# Altium schematic sheet SIM800.SchDoc
size A3
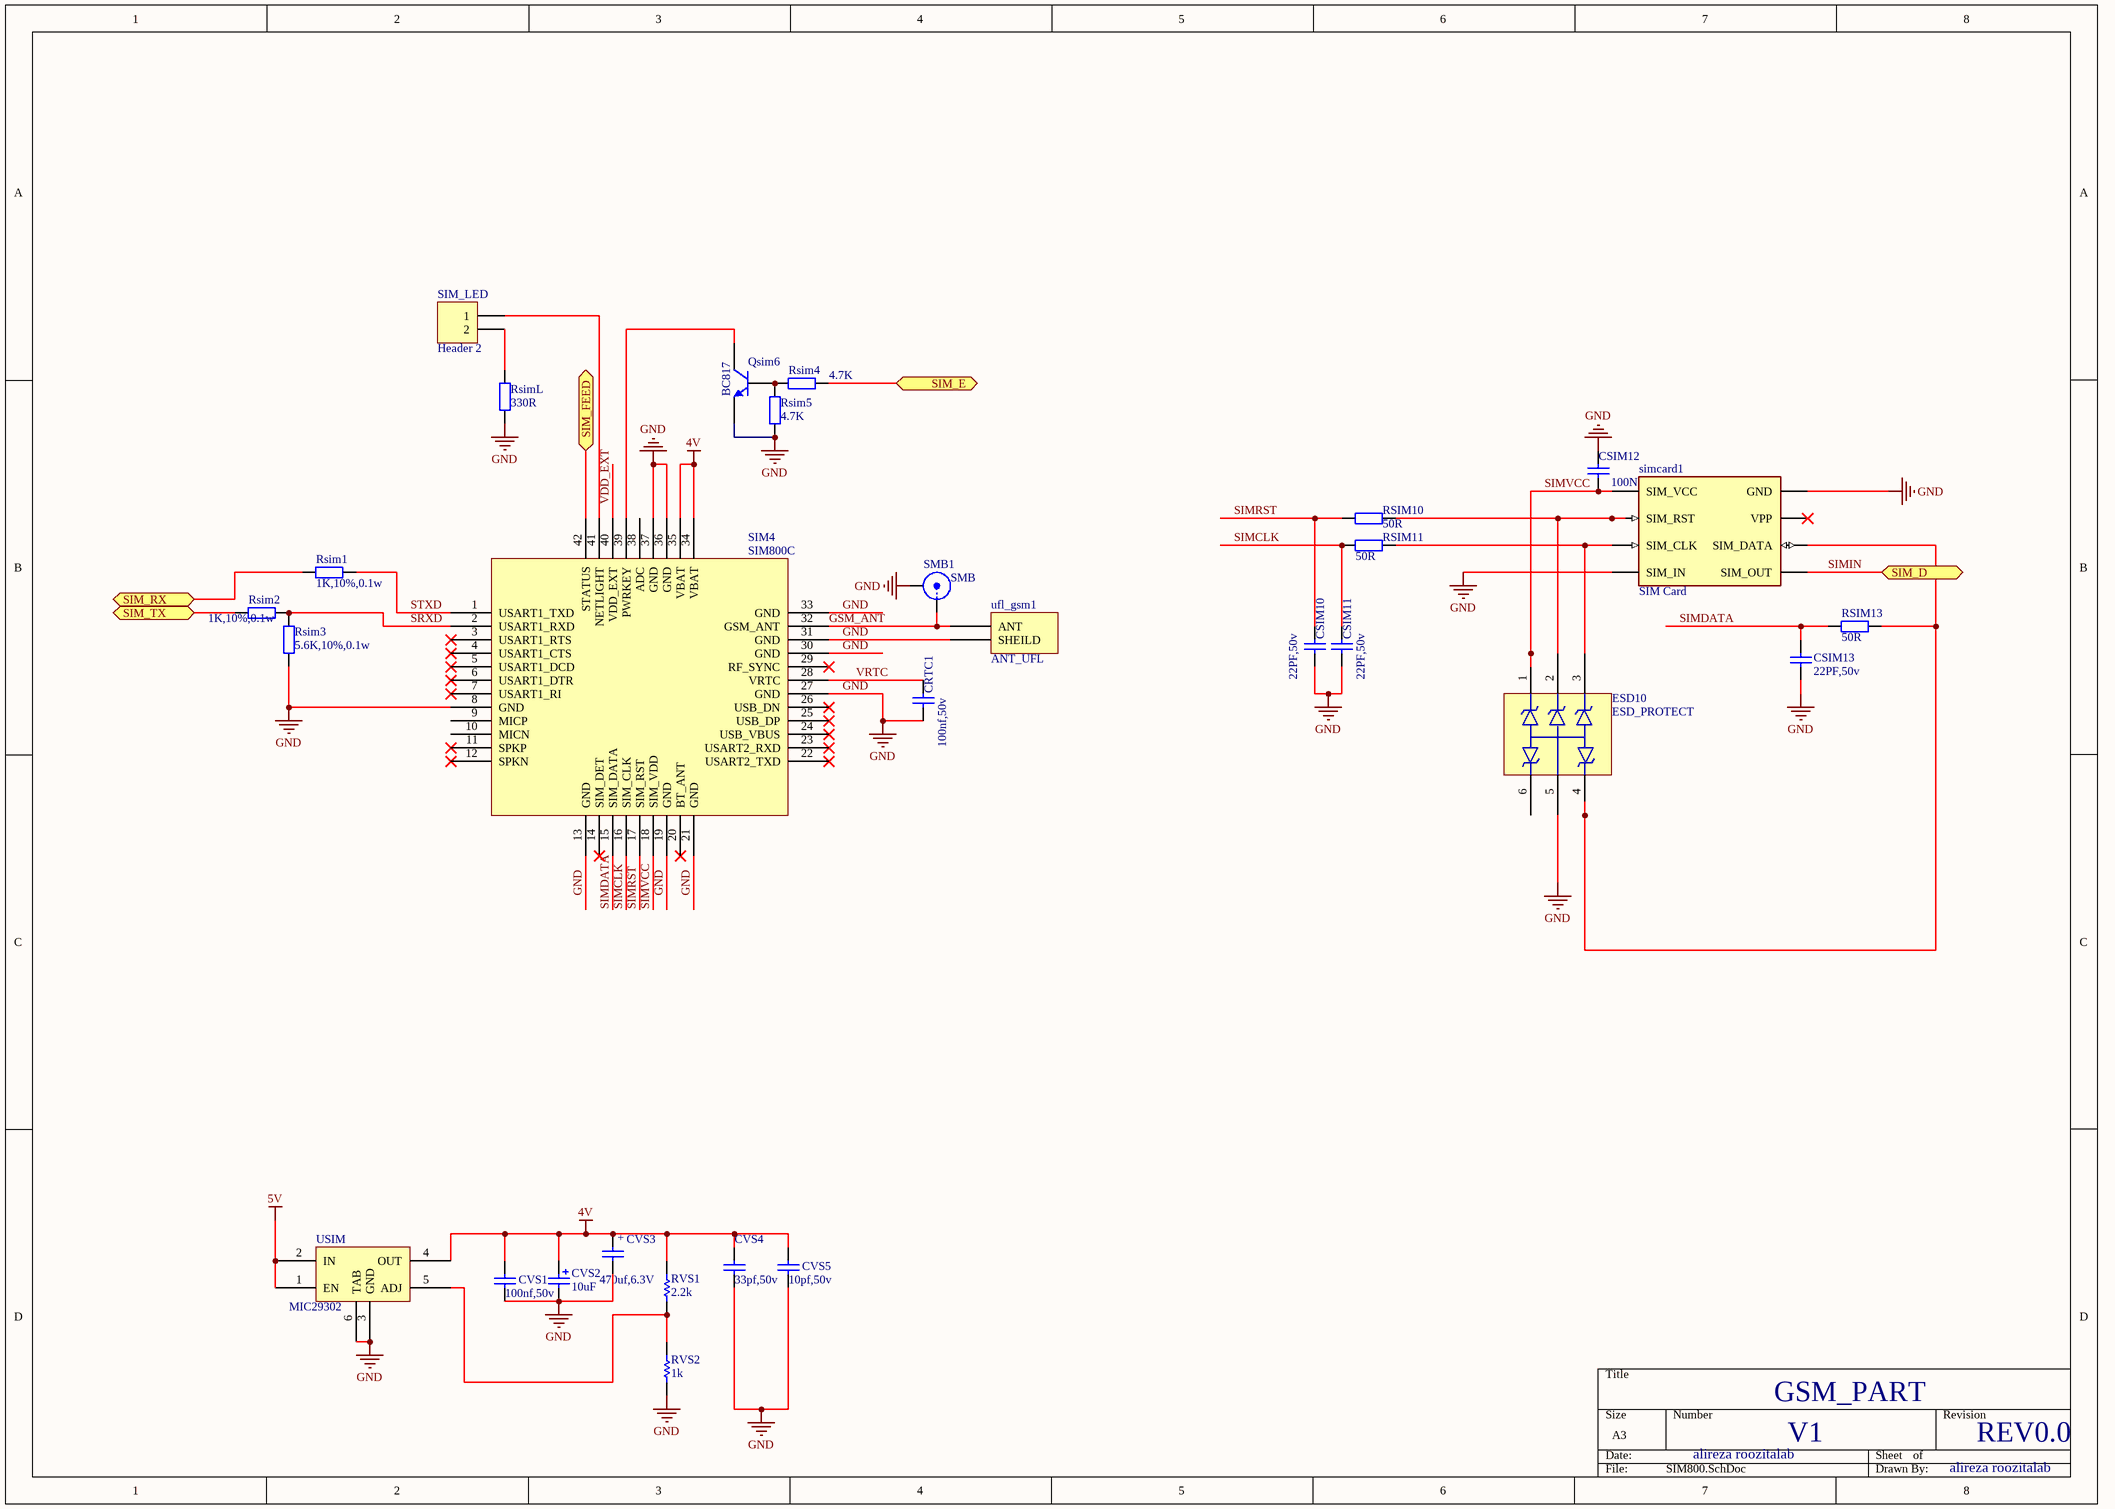
[diagram p0: SIM800.SchDoc]

## Parts
CRTC1  100nf,50v  [0805.]
CSIM10  22PF,50v  [0805.]
CSIM11  22PF,50v  [0805.]
CSIM12  100N  [0805.]
CSIM13  22PF,50v  [0805.]
CVS1  100nf,50v  [0805.]
CVS2  10uF  [C1206.]
CVS3  470uf,6.3V  [MY_SMC_D]
CVS4  33pf,50v  [0805.]
CVS5  10pf,50v  [0805.]
ESD10  ESD_PROTECT  [SMF05]
Qsim6  BC817  [2N3906_SMD]
Rsim1  1K,10%,0.1w  [0805.]
Rsim2  1K,10%,0.1w  [0805.]
Rsim3  5.6K,10%,0.1w  [0805.]
Rsim4  value 4.7K  [0805.]  (hidden comment: 10K,10%,0.1w)
Rsim5  value 4.7K  [0805.]  (hidden comment: 10K,10%,0.1w)
RSIM10  value 50R  [0805.]  (hidden comment: 47R,10%,0.1w)
RSIM11  value 50R  [0805.]  (hidden comment: 47R,10%,0.1w)
RSIM13  value 50R  [0805.]  (hidden comment: 47R,10%,0.1w)
RsimL  value 330R  [0805.]  (hidden comment: 330R,10%,0.1w)
RVS1  2.2k  [0805.]
RVS2  1k  [0805.]
SIM4  SIM800C  [SIM800C]
SIM_LED  Header 2  [HDR1X2]
simcard1  SIM Card  [MY_SIMCARD]
SMB1  SMB  [SMB_V-RJ45]
ufl_gsm1  ANT_UFL  [UFL_CON]
USIM  MIC29302  [MIC29302]

## Ports
SIM_D (bidir), SIM_E (bidir), SIM_FEED (bidir), SIM_RX (bidir), SIM_TX (bidir)

## Nets
4V: CVS1.2 CVS2.1 CVS3.+ CVS4.2 CVS5.2 RVS1.2 SIM4.34(VBAT) SIM4.35(VBAT) USIM.4(OUT)
5V: USIM.1(EN) USIM.2(IN)
GND: CRTC1.1 CSIM10.1 CSIM11.1 CSIM12.2 CSIM13.1 CVS1.1 CVS2.2 CVS3.- CVS4.1 CVS5.1 ESD10.5 Qsim6.1(E) Rsim3.1 Rsim5.1 RsimL.1 RVS2.1 SIM4.8(GND) SIM4.13(GND) SIM4.19(GND) SIM4.21(GND) SIM4.27(GND) SIM4.30(GND) SIM4.31(GND) SIM4.33(GND) SIM4.36(GND) SIM4.37(GND) simcard1.C4(SIM_IN) simcard1.C5(GND) SMB1.2(Y) ufl_gsm1.1(SHEILD) USIM.3(GND) USIM.6(TAB)
GSM_ANT: SIM4.32(GSM_ANT) SMB1.1(X) ufl_gsm1.2(ANT)
SIM_E: Rsim4.1 ; port SIM_E
SIM_FEED: SIM4.42(STATUS) ; port SIM_FEED
SIM_RX: Rsim1.2 ; port SIM_RX
SIM_TX: Rsim2.1 ; port SIM_TX
SIMCLK: CSIM11.2 RSIM11.1 SIM4.16(SIM_CLK)
SIMDATA: CSIM13.2 RSIM13.1 SIM4.15(SIM_DATA)
SIMIN: simcard1.C8(SIM_OUT) ; port SIM_D
SIMRST: CSIM10.2 RSIM10.1 SIM4.17(SIM_RST)
SIMVCC: CSIM12.1 ESD10.1 SIM4.18(SIM_VDD) simcard1.C1(SIM_VCC)
SRXD: Rsim2.2 Rsim3.2 SIM4.2(USART1_RXD)
STXD: Rsim1.1 SIM4.1(USART1_TXD)
VDD_EXT: SIM4.40(VDD_EXT)
VRTC: CRTC1.2 SIM4.28(VRTC)
NetESD10_2: ESD10.2 RSIM10.2 simcard1.C2(SIM_RST)
NetESD10_3: ESD10.3 RSIM11.2 simcard1.C3(SIM_CLK)
NetESD10_4: ESD10.4 RSIM13.2 simcard1.C7(SIM_DATA)
NetQsim6_2: Qsim6.2(B) Rsim4.2 Rsim5.2
NetQsim6_3: Qsim6.3(C) SIM4.39(PWRKEY)
NetRsimL_2: RsimL.2 SIM_LED.2
NetRVS1_1: RVS1.1 RVS2.2 USIM.5(ADJ)
NetSIM4_41: SIM4.41(NETLIGHT) SIM_LED.1

Not connected (* = marked no-connect by the designer): ESD10 6; SIM4 3(USART1_RTS)* 4(USART1_CTS)* 5(USART1_DCD)* 6(USART1_DTR)* 7(USART1_RI)* 9(MICP) 10(MICN) 11(SPKP)* 12(SPKN)* 14(SIM_DET)* 20(BT_ANT)* 22(USART2_TXD)* 23(USART2_RXD)* 24(USB_VBUS)* 25(USB_DP)* 26(USB_DN)* 29(RF_SYNC)* 38(ADC); simcard1 C6(VPP)*

## Notes on the sheet
- alireza roozitalab
- GSM_PART
- V1
- REV0.0

## Library data of the parts
CRTC1 CSIM10-CSIM13 CVS1 CVS4 CVS5 = Cap: Capacitor; Published: 8-Jun-2000; LatestRevisionDate: 17-Jul-2002; LatestRevisionNote: Re-released for DXP Platform.; PackageReference: RAD-0.3; Publisher: Altium Limited
CVS2 = Cap Pol1: Polarized Capacitor (Radial); Published: 8-Jun-2000; Revision: July-2002: Re-released for DXP Platform.; Publisher: Altium Limited; Value: 10uF
CVS3 = Cap Pol: Polar capacitor; ASiD Part Number: C-AS; Volte: 35v; Value: 470uf,6.3V
Qsim6 = 2N3904: NPN General Purpose Amplifier; pin to pad: 1>2 2>1; Published: 8-Jun-2000; LatestRevisionDate: 15-Jan-2003; LatestRevisionNote: PCB Footprint 'BCY-W3/D4.7' replaced; DatasheetDocument: 1997; PackageDocument: Sep-1998; PackageReference: TO-92A; Publisher: Altium Limited; Code_JEDEC: TO-92A; ComponentLink1Description: Manufacturer Link; ComponentLink1URL: http://www.fairchildsemi.com/; ComponentLink2Description: Datasheet; ComponentLink2URL: http://www.fairchildsemi.com/ds/2N%2F2N3904.pdf
Rsim1-Rsim5 RSIM10 RSIM11 RSIM13 RsimL = Res2: Resistor; Published: 8-Jun-2000; LatestRevisionDate: 17-Jul-2002; LatestRevisionNote: Re-released for DXP Platform.; PackageReference: AXIAL-0.4; Publisher: Altium Limited
  RSIM10 RSIM11 RSIM13: PackageDescription: Axial Device, Thru-Hole; 2 Leads; 0.4 in Pin Spacing
RVS1 = Res1: Resistor; Value: 1K; Published: 8-Jun-2000; Revision: July-2002: Re-released for DXP Platform.; Publisher: Altium Limited
RVS2 = Res1: Resistor; Published: 8-Jun-2000; Revision: July-2002: Re-released for DXP Platform.; Publisher: Altium Limited; Value: 1K
SIM_LED = Header 2: Header, 2-Pin; LatestRevisionDate: 17-Jul-2002; LatestRevisionNote: Re-released for DXP Platform.; Publisher: Altium Limited
SMB1 = SMB: SMB Straight Connector; LatestRevisionDate: 17-Jul-2002; LatestRevisionNote: Re-released for DXP Platform.; Publisher: Altium Limited